# EAGLE schematic arduino odj-raptor (EAGLE 7.6.0)
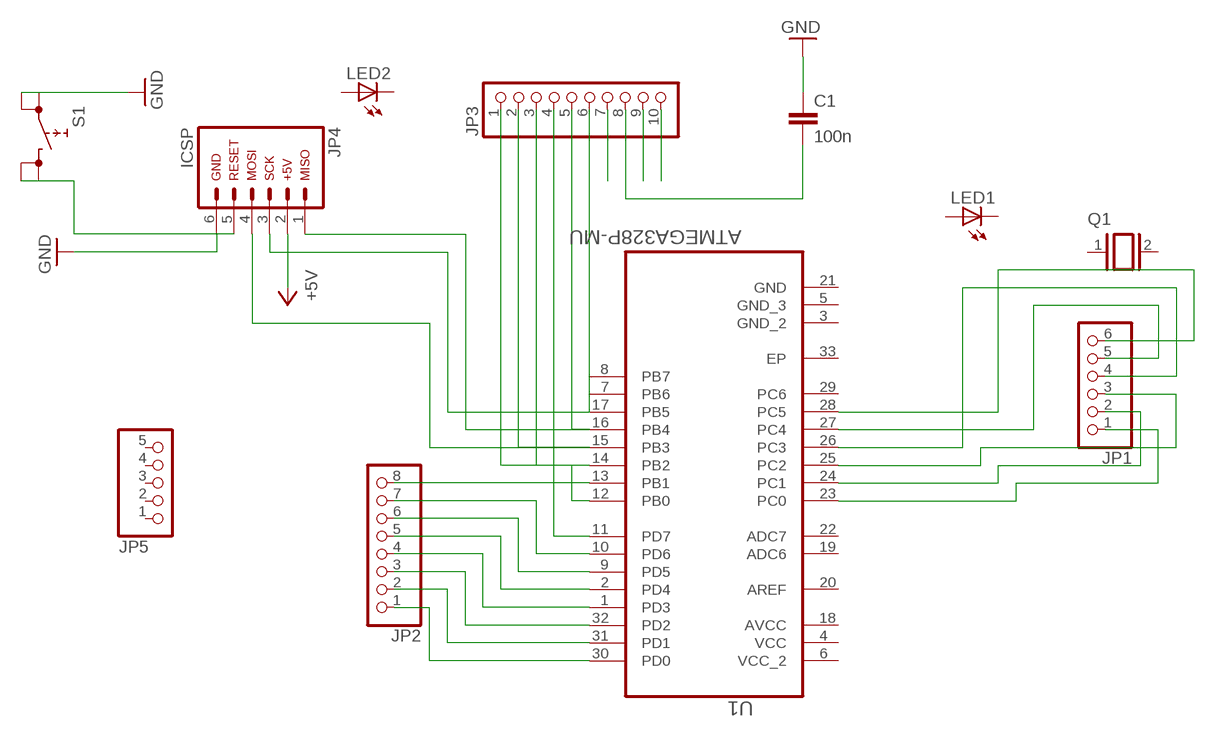
[diagram p0: schematic, sheet 1]

## Parts
C1  100n  C2,5-3  [C2.5-3]
JP1  PINHD-1X6  [1X06]
JP2  PINHD-1X8  [1X08]
JP3  PINHD-1X10  [1X10]
JP4  ARDUINO_CONN-ICSP  [CONN-2X03]
JP5  PINHD-1X5  [1X05]
LED1  LED  [SMARTLED-TTW]
LED2  LED  [SMARTLED-TTW]
Q1  XTAL/S  [QS]
S1  REKN  [REKN]
U1  ATMEGA328P-MU  [QFN50P500X500X100-33N]

## Nets
+5V: JP4.2
GND: C1.1 JP4.6
N$1: JP1.1 U1.23(PC0)
N$2: JP1.2 U1.24(PC1)
N$3: JP1.3 U1.25(PC2)
N$4: JP1.4 JP1.6 U1.26(PC3) U1.28(PC5)
N$5: JP1.5 U1.27(PC4)
N$6: JP3.2 U1.13(PB1)
N$7: JP2.1 U1.30(PD0)
N$8: JP2.2 U1.31(PD1)
N$9: JP2.3 U1.32(PD2)
N$10: JP2.4 U1.1(PD3)
N$11: JP2.5 U1.2(PD4)
N$12: JP2.6 U1.9(PD5)
N$13: JP2.7 U1.10(PD6)
N$14: JP2.8 U1.11(PD7)
N$15: JP3.1 U1.12(PB0)
N$16: JP3.3 U1.14(PB2)
N$17: JP3.4 JP4.4 U1.15(PB3)
N$18: JP3.5 JP4.1 U1.16(PB4)
N$19: JP3.6 JP4.3 U1.17(PB5)
N$20: JP3.10
N$21: JP3.9
N$22: C1.2 JP3.8
N$23: JP3.7
N$28: JP4.5 S1.1A S1.1B
N$29: S1.0A S1.0B ; supply symbol labelled GND
Unconnected: JP5.1 JP5.2 JP5.3 JP5.4 JP5.5 LED1.A@1(A) LED1.C@1(C) LED2.A@1(A) LED2.C@1(C) Q1.1 Q1.2 U1.3(GND_2) U1.5(GND_3) U1.7(PB6) U1.8(PB7) U1.19(ADC6) U1.20(AREF) U1.21(GND) U1.22(ADC7) U1.29(PC6) U1.33(EP)

## Power pins joined to a net without a drawn wire
AVCC: U1.18(AVCC)
VCC: U1.4(VCC)
VCC_2: U1.6(VCC_2)

## Library data of the parts
C1 = capacitor-wima:C: CAPACITOR naming: grid - package width
JP1 = pinhead:PINHD-1X6: PIN HEADER
JP2 = pinhead:PINHD-1X8: PIN HEADER
JP3 = pinhead:PINHD-1X10: PIN HEADER
JP4 = arduino_jw:ARDUINO_CONN-ICSP: Arduino ICSP I/O Header This is the ICSP I/O header on the Arduino Uno R3. This connector is labeled with the following pin assignments: MISO +5V SCK MOSI RESET GND NOTE: Be sure you install this connector with the correct orientation on your PCB layout. Pin 1 has a square pad to assist with orientation.
JP5 = pinhead:PINHD-1X5: PIN HEADER
LED1 LED2 = led:LED: LED OSRAM: - CHIPLED LG R971, LG N971, LY N971, LG Q971, LY Q971, LO R971, LY R971 LH N974, LH R974 LS Q976, LO Q976, LY Q976 LO Q996 - Hyper CHIPLED LW Q18S LB Q993, LB Q99A, LB R99A - SideLED LS A670, LO A670, LY A670, LG A670, LP A670 LB A673, LV A673, LT A673, LW A673 LH A674 LY A675 LS A676, LA A676, LO A676, LY A676, LW A676 LS A679, LY A679, LG A679 - Hyper Micro SIDELED® LS Y876, LA Y876, LO Y876, LY Y876 LT Y87S - SmartLED LW L88C, LW L88S LB L89C, LB L89S, LG L890 LS L89K, LO L89K, LY L89K LS L896, LA L896, LO L896, LY L896 - TOPLED LS T670, LO T670, LY T670, LG T670, LP T670 LSG T670, LSP T670, LSY T670, LOP T670, LYG T670 LG T671, LOG T671, LSG T671 LB T673, LV T673, LT T673, LW T673 LH T674 LS T676, LA T676, LO T676, LY T676, LB T676, LH T676, LSB T676, LW T676 LB T67C, LV T67C, LT T67C, LS T67K, LO T67K, LY T67K, LW E67C LS E67B, LA E67B, LO E67B, LY E67B, LB E67C, LV E67C, LT E67C LW T67C LS T679, LY T679, LG T679 LS T770, LO T770, LY T770, LG T770, LP T770 LB T773, LV T773, LT T773, LW T773 LH T774 LS E675, LA E675, LY E675, LS T675 LS T776, LA T776, LO T776, LY T776, LB T776 LHGB T686 LT T68C, LB T68C - Hyper Mini TOPLED® LB M676 - Mini TOPLED Santana® LG M470 LS M47K, LO M47K, LY M47K Source: http://www.osram.convergy.de LUXEON: - LUMILED® LXK2-PW12-R00, LXK2-PW12-S00, LXK2-PW14-U00, LXK2-PW14-V00 LXK2-PM12-R00, LXK2-PM12-S00, LXK2-PM14-U00 LXK2-PE12-Q00, LXK2-PE12-R00, LXK2-PE12-S00, LXK2-PE14-T00, LXK2-PE14-U00 LXK2-PB12-K00, LXK2-PB12-L00, LXK2-PB12-M00, LXK2-PB14-N00, LXK2-PB14-P00, LXK2-PB14-Q00 LXK2-PR12-L00, LXK2-PR12-M00, LXK2-PR14-Q00, LXK2-PR14-R00 LXK2-PD12-Q00, LXK2-PD12-R00, LXK2-PD12-S00 LXK2-PH12-R00, LXK2-PH12-S00 LXK2-PL12-P00, LXK2-PL12-Q00, LXK2-PL12-R00 Source: www.luxeon.com KINGBRIGHT: KA-3528ASYC Source: www.kingbright.com
Q1 = special:XTAL/S: CRYSTAL
S1 = switch:REKN: PUSH SWITCH ITT-Cannon-Cannon
U1 = Ava:ATMEGA328P-MU: Programmable Flash; MPN: ATMEGA328P-MU; OC_FARNELL: 1748522; OC_NEWARK: 26R2526; PACKAGE: QFN-32; SUPPLIER: Atmel